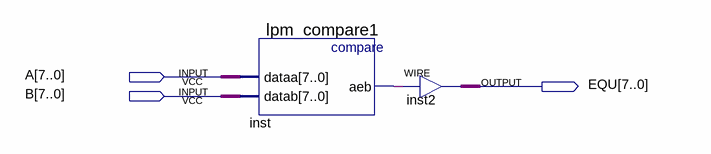
[diagram p0: schematic sheet]
// Quartus schematic EQU_.bdf as structural Verilog: 2 symbols, 3 pins
module EQU_ (
  input  [7:0] A,
  input  [7:0] B,
  output [7:0] EQU
);

  wire inst_aeb;

  lpm_compare1 inst (.dataa(A), .datab(B), .aeb(inst_aeb));
  assign EQU = {8{inst_aeb}};  // WIRE inst2
endmodule
